# EasyEDA schematic SCH_SmartHealthMonitor_2021-09-16.json
TITLE: Health Monitor Sticker; REV: 1.0; Date: 2021-09-16; Sheet: 1/1; Drawn By: naumanshakir; Company: Your Company
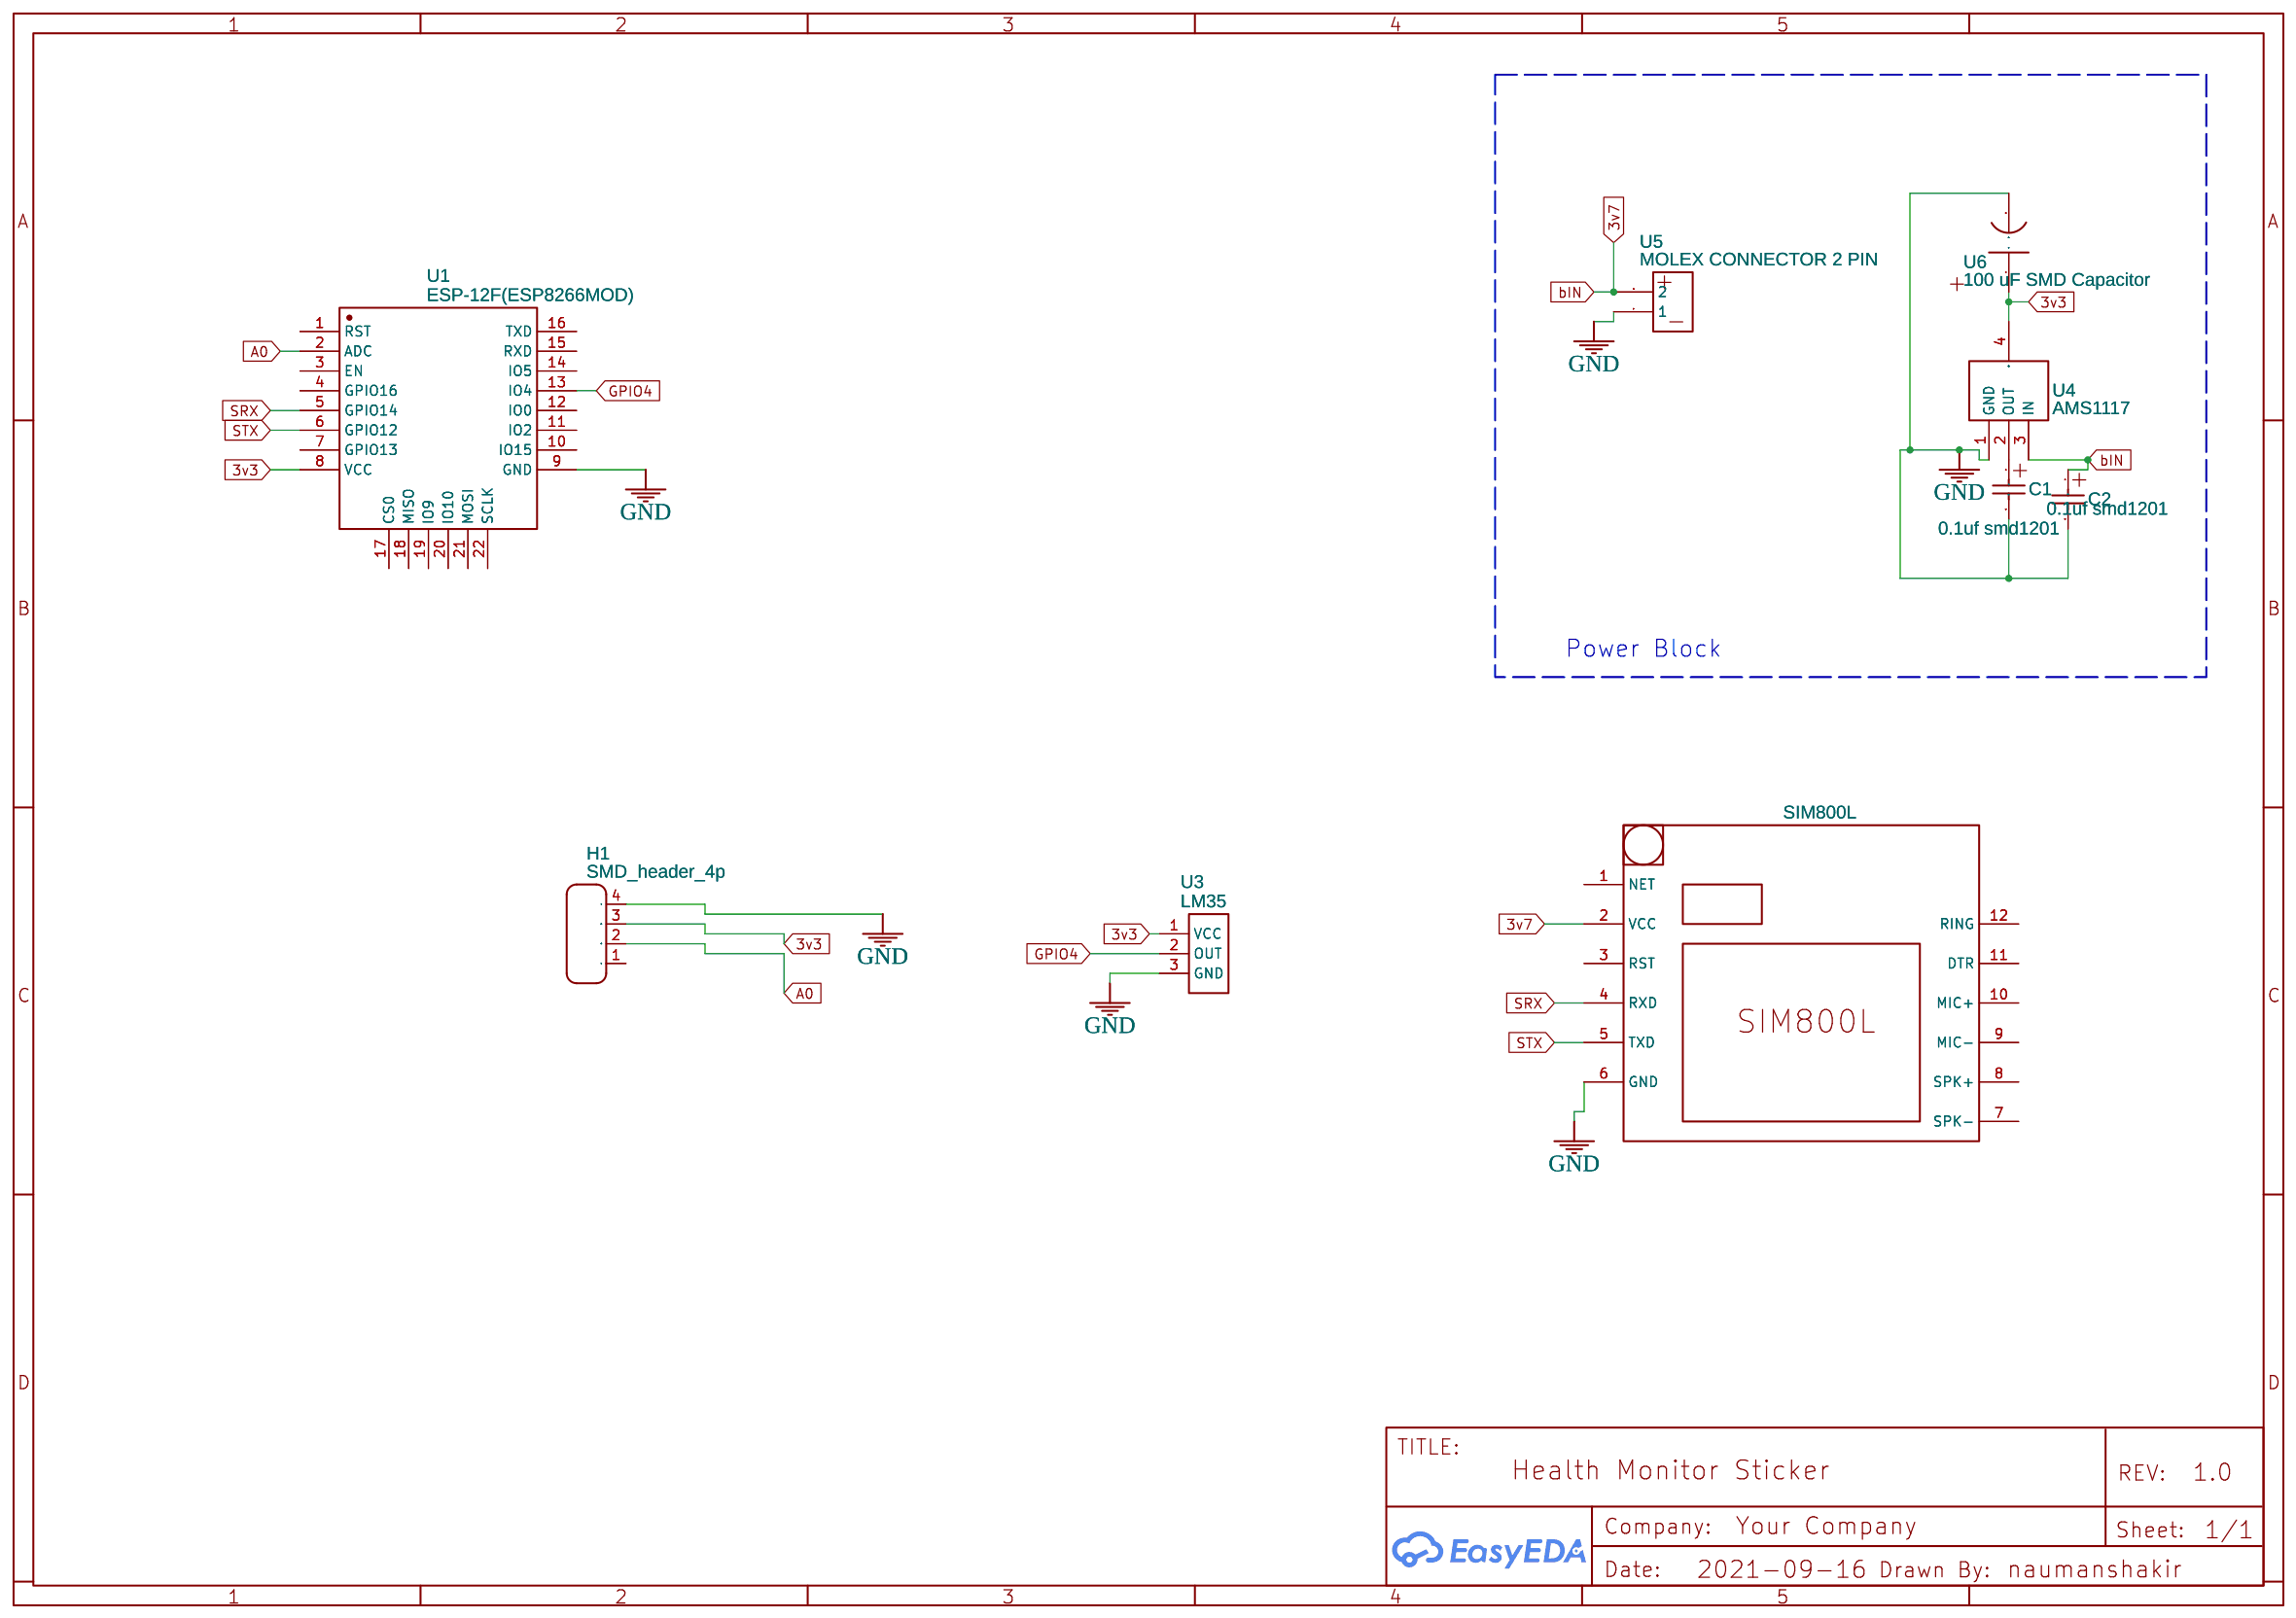
[diagram p0: schematic sheet]

## Parts
C1  0.1uf smd1201  [0.1UF CAPACITOR]
C2  0.1uf smd1201  [0.1UF CAPACITOR]
H1  SMD_header_4p  [SMD_HEADER_4P]
NET  SIM800L  [SIM800L]
U1  ESP-12F(ESP8266MOD)  [WIFIM-SMD_ESP-12F-ESP8266MOD]
U3  LM35  [TO-92-3_L5.1-W4.1-P1.27-L]
U4  AMS1117  [AMS_1117_SOT223]
U5  MOLEX CONNECTOR 2 PIN  [MOLEX 2P]
U6  100 uF SMD Capacitor  [100UF_CAPACITOR1]

## Library data of the parts
C1 C2 = 0.1uf smd1201: Contributor: uniqengineeringworks
H1 = SMD_header_4p: Contributor: Ihor Panas
NET = SIM800L: Manufacturer: ARCELI; Supplier: Amazon; Contributor: ulf.modig
U1 = ESP-12F(ESP8266MOD): Supplier: LCSC; Manufacturer: Ai-Thinker; Supplier Part: C82891; JLCPCB Part Class: Extended Part
U3 = LM35: Manufacturer: TEXAS INSTRUMENTS; Supplier: Mouser; Supplier Part: 926-LM35DZ/NOPB; link: http://www.ti.com/lit/ds/symlink/lm35.pdf; Contributor: Jesus J.
U4 = AMS1117: Manufacturer: RoHS compliant; Supplier: LCSC; Contributor: jailer21
U5 = MOLEX CONNECTOR 2 PIN: Manufacturer Part: MOLEX SMD CONNECTOR 2 PIN; Contributor: chacallumineux
U6 = 100 uF SMD Capacitor: Manufacturer Part: JMK325ABJ107MM-T; Contributor: megaveganzombie; Supplier Part: C92794; Supplier: LCSC; link: https://lcsc.com/product-detail/Multilayer-Ceramic-Capacitors-MLCC-SMD-SMT_TAIYO-YUDEN_JMK325BJ107MM-T_100uF-107-20-6-3V_C92794.html

## Nets
3v3: H1.3 U1.8(VCC) U3.1(VCC) U4.4(GND) U6.1
3v7: C2.1 NET.2(VCC) U4.3(IN) U5.2
GND: C1.2 C2.2 H1.4 NET.6(GND) U1.9(GND) U3.3(GND) U4.1(GND) U5.1 U6.2
A0: H1.2 U1.2(ADC)
GPIO4: U1.13(IO4) U3.2(OUT)
SRX: NET.4(RXD) U1.5(GPIO14)
STX: NET.5(TXD) U1.6(GPIO12)
Net-(C1-1): C1.1 U4.2(OUT)

Not connected (* = marked no-connect by the designer): H1 1; NET 1(NET) 3(RST) 7(SPK-) 8(SPK+) 9(MIC-) 10(MIC+) 11(DTR) 12(RING); U1 1(RST) 3(EN) 4(GPIO16) 7(GPIO13) 10(IO15) 11(IO2) 12(IO0) 14(IO5) 15(RXD) 16(TXD) 17(CS0) 18(MISO) 19(IO9) 20(IO10) 21(MOSI) 22(SCLK)

## Notes on the sheet
- Power Block
